# Altium schematic sheet current amplifier 06.SchDoc: PHOTOELECTRIC EFFECT
size A3; ApprovedBy: NHOPPASIT S.; CheckedBy: NHOPPASIT S.; Author: NHOPPASIT S.; DrawnBy: NHOPPASIT S.; DocumentNumber: EE-01; Revision: 1; SheetNumber: 1; SheetTotal: 1; Size: A3; PageSetup: Record=PageOptions|CenterHorizontal=True|CenterVertical=True|PrintScale=0.73|XCorrection=1.00|YCorrection=1.00|PrintKind=0|BorderSize=5000000|LeftOffset=0|BottomOffset=0|Orientation=2|PaperLength=1000|PaperWidth=1000|Scale=100|PaperSource=7|PrintQuality=-3|MediaType=1|DitherType=10|PrintScaleMode=1|PaperKind=A4|PaperIndex=9; DocumentName: PHOTOELECTRIC EFFECT SCH; ProjectName: PHOTOELECTRIC EFFECT 01
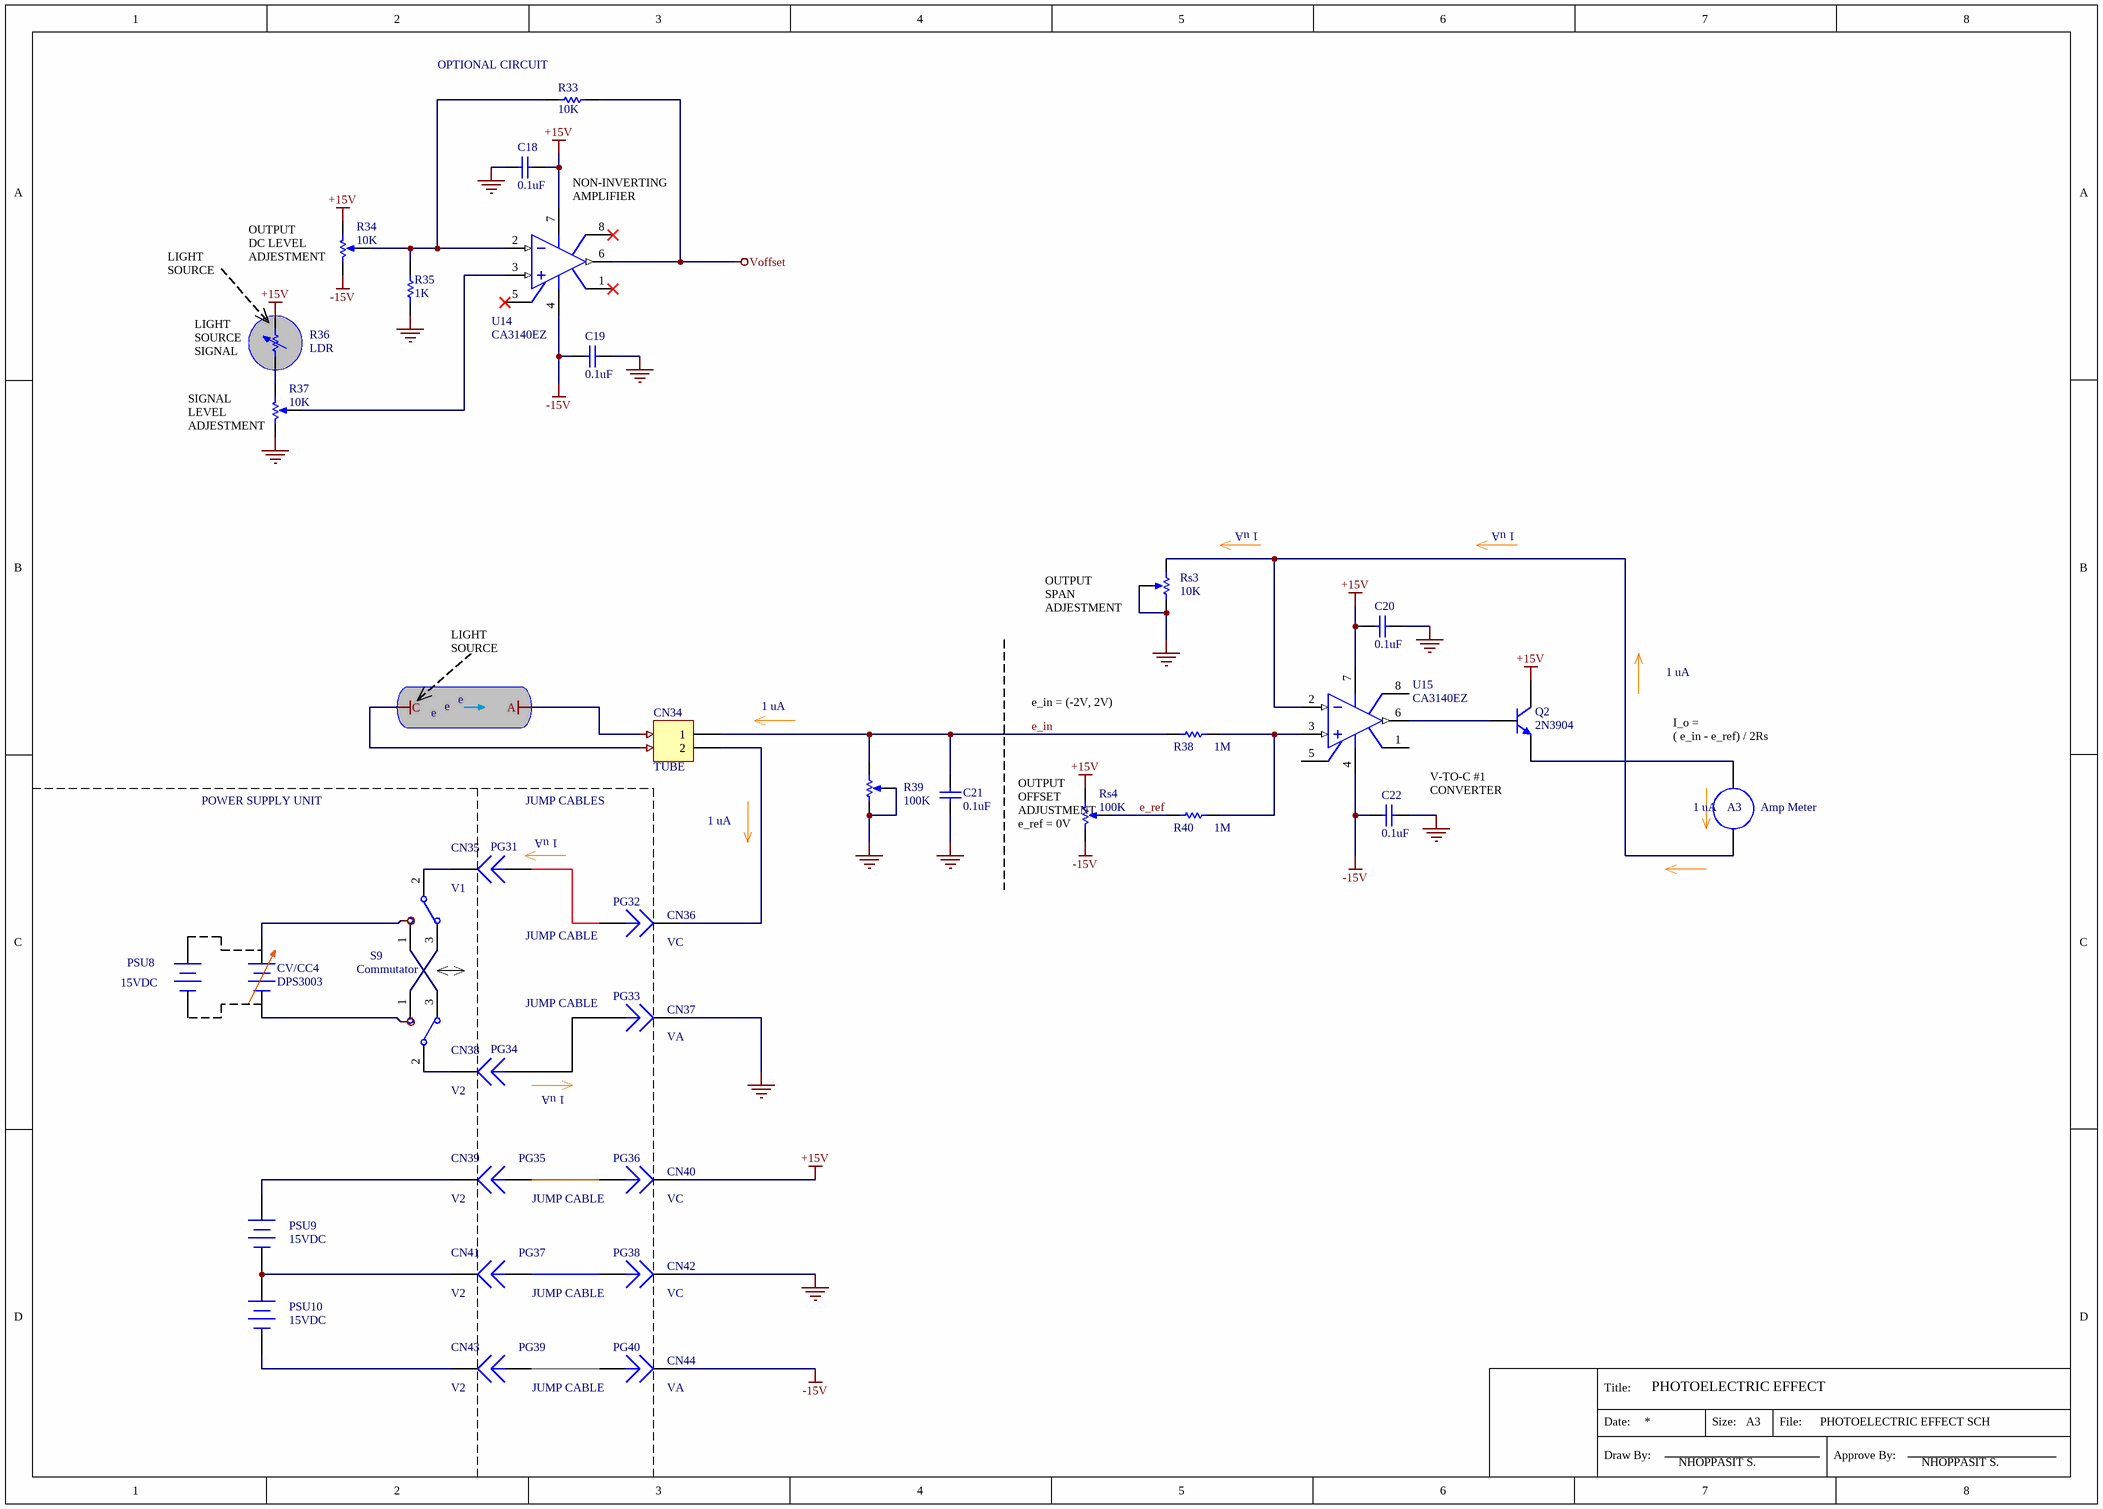
[diagram p0: current amplifier 06.SchDoc]

## Parts
A3  Amp Meter  [RAD-0.1]
C18  0.1uF  [RAD-0.3]
C19  0.1uF  [RAD-0.3]
C20  0.1uF  [RAD-0.3]
C21  0.1uF  [RAD-0.3]
C22  0.1uF  [RAD-0.3]
CN34  TUBE  [HDR1X2]
CN35  V1  [PIN1]
CN36  VC  [PIN1]
CN37  VA  [PIN1]
CN38  V2  [PIN1]
CN39  V2  [PIN1]
CN40  VC  [PIN1]
CN41  V2  [PIN1]
CN42  VC  [PIN1]
CN43  V2  [PIN1]
CN44  VA  [PIN1]
CV/CC4  DPS3003  [BAT-2]
PG31  Plug  [PIN1]  (value not drawn)
PG32  Plug  [PIN1]  (value not drawn)
PG33  Plug  [PIN1]  (value not drawn)
PG34  Plug  [PIN1]  (value not drawn)
PG35  Plug  [PIN1]  (value not drawn)
PG36  Plug  [PIN1]  (value not drawn)
PG37  Plug  [PIN1]  (value not drawn)
PG38  Plug  [PIN1]  (value not drawn)
PG39  Plug  [PIN1]  (value not drawn)
PG40  Plug  [PIN1]  (value not drawn)
PSU8  15VDC  [BAT-2]
PSU9  15VDC  [BAT-2]
PSU10  15VDC  [BAT-2]
Q2  2N3904  [TO-92A]
R33  10K  [AXIAL-0.3]
R34  10K  [VR5]
R35  1K  [AXIAL-0.3]
R36  LDR  [AXIAL-0.7]
R37  10K  [VR5]
R38  1M  [AXIAL-0.3]
R39  100K  [VR5]
R40  1M  [AXIAL-0.3]
Rs3  10K  [VR5]
Rs4  100K  [VR5]
S9  Commutator  [TL36WW15050]
S10  SW-SPDT  [TL36WW15050]  (value not drawn)
U14  CA3140EZ  [H-08A]
U15  CA3140EZ  [H-08A]

## Nets
+15V: C18.2 C20.1 CN40.1 Q2.3(C) R34.1(TOP) R36.2 Rs4.1(TOP) U14.7(V+) U15.7(V+)
-15V: C19.1 C22.1 CN44.1 R34.2(BOT) Rs4.2(BOT) U14.4(V-) U15.4(V-)
A: CV/CC4.1(+) CV/CC4.2(-)  [also labelled C, VCC]
GND: C18.1 C19.2 C20.2 C21.1 C22.2 CN37.1 CN42.1 R35.1 R37.2(BOT) R39.1(TOP) R39.3(TAP) Rs3.2(BOT) Rs3.3(TAP)
Voffset: R33.2 U14.6(OUT)
e_in: C21.2 CN34.1 R38.1 R39.2(BOT)
e_ref: R40.1 Rs4.3(TAP)
NetA3_1: A3.1 Rs3.1(TOP) U15.2(IN-)
NetA3_2: A3.2 Q2.1(E)
NetCN34_2: CN34.2 CN36.1
NetCN35_1: CN35.1 S9.2
NetCN38_1: CN38.1 S10.2
NetCN39_1: CN39.1 PSU9.1(+)
NetCN41_1: CN41.1 PSU9.2(-) PSU10.1(+)
NetCN43_1: CN43.1 PSU10.2(-)
NetPG31_1: PG31.1 PG32.1
NetPG33_1: PG33.1 PG34.1
NetPG35_1: PG35.1 PG36.1
NetPG37_1: PG37.1 PG38.1
NetPG39_1: PG39.1 PG40.1
NetQ2_2: Q2.2(B) U15.6(OUT)
NetR33_1: R33.1 R34.3(TAP) R35.2 U14.2(IN-)
NetR36_1: R36.1 R37.1(TOP)
NetR37_3: R37.3(TAP) U14.3(IN+)
NetR38_2: R38.2 R40.2 U15.3(IN+)
NetS9_1: S9.1 S10.3
NetS9_3: S9.3 S10.1

Not connected (* = marked no-connect by the designer): PSU8 1(+) 2(-); U14 1(OS_NUL)* 5(OS_NUL)* 8(TAB)*; U15 1(OS_NUL) 5(OS_NUL) 8(TAB)

## Notes on the sheet
- (near R33) OPTIONAL CIRCUIT
- NON-INVERTING
  AMPLIFIER
- LIGHT SOURCE
- (near R34) OUTPUT
  DC LEVEL
  ADJESTMENT
- (near R36) LIGHT SOURCE
  SIGNAL
- (near R37) SIGNAL
  LEVEL
  ADJESTMENT
- 1 uA
- (near Rs3) OUTPUT
  SPAN
  ADJESTMENT
- e
- e_in = (-2V, 2V)
- (near A3) I_o =
  ( e_in - e_ref) / 2Rs
- POWER SUPPLY UNIT
- JUMP CABLES
- (near PG31) 1 uA
- (near Rs4) OUTPUT
  OFFSET
  ADJUSTMENT
  e_ref = 0V
- V-TO-C #1
  CONVERTER
- (near A3) 1 uA
- JUMP CABLE
- (near PG34) 1 uA
- Title:
- Date:
- Draw By:
- Size:
- File:
- Approve By:

## Library data of the parts
A3 = Meter: Indicating Instrument; Note: Place a "letter" into the symbol to show the function of the meter or instrument; Published: 24-Mar-1999; LatestRevisionDate: 17-Jul-2002; LatestRevisionNote: Re-released for DXP Platform.; PackageReference: RAD-0.1; Publisher: Altium Limited; PackageDescription: Radial Cap, Thru-Hole; 2 Leads; 0.1 in Pin Spacing
C18-C22 = Cap: Capacitor; Published: 8-Jun-2000; LatestRevisionDate: 17-Jul-2002; LatestRevisionNote: Re-released for DXP Platform.; PackageReference: RAD-0.3; Publisher: Altium Limited; PackageDescription: Radial Cap, Thru-Hole; 2 Leads; 0.3 in Pin Spacing; Value: 0.1uF
CN34 = Header 2: Header, 2-Pin; LatestRevisionDate: 17-Jul-2002; LatestRevisionNote: Re-released for DXP Platform.; Publisher: Altium Limited
CN35-CN44 = Socket: LatestRevisionDate: 17-Jul-2002; LatestRevisionNote: Re-released for DXP Platform.; Publisher: Altium Limited
CV/CC4 PSU8-PSU10 = Battery: Multicell Battery; Published: 24-Mar-1999; LatestRevisionDate: 17-Jul-2002; LatestRevisionNote: Re-released for DXP Platform.; PackageReference: BAT-2; Publisher: Altium Limited; PackageDescription: Battery; 2 Leads
Q2 = 2N3904: NPN General Purpose Amplifier; Published: 8-Jun-2000; LatestRevisionDate: 15-Jan-2003; LatestRevisionNote: PCB Footprint 'BCY-W3/D4.7' replaced; DatasheetVersion: 1997; PackageVersion: Sep-1998; PackageReference: TO-92A; Publisher: Altium Limited; PackageDescription: TO, Flat Index; 3 In-Line, Axial Leads; Body Dia. 4.5mm; Leads 0.51 x 0.48 mm (max); ComponentLink1Description: Manufacturer Link; ComponentLink1URL: http://www.fairchildsemi.com/; ComponentLink2Description: Datasheet; ComponentLink2URL: http://www.fairchildsemi.com/ds/2N%2F2N3904.pdf
R33 R35 R38 R40 = Res1: Resistor; Published: 8-Jun-2000; LatestRevisionDate: 17-Jul-2002; LatestRevisionNote: Re-released for DXP Platform.; PackageReference: AXIAL-0.3; Publisher: Altium Limited; PackageDescription: Axial Device, Thru-Hole; 2 Leads; 0.3 in Pin Spacing
  R33: Value: 10K
  R35: Value: 1K
  R38 R40: Value: 1M
R34 R37 R39 Rs3 Rs4 = RPot: Potentiometer; Sim Note: Enter the Resistance value and the set point into parameter fields.; Set Position: 0.5; Published: 8-Jun-2000; LatestRevisionDate: 17-Jul-2002; LatestRevisionNote: Re-released for DXP Platform.; PackageReference: VR5; Publisher: Altium Limited; PackageDescription: Variable Resistor, Thru-Hole; 3 Leads
  R34 R37 Rs3: Value: 10K
  R39 Rs4: Value: 100K
R36 = Res Adj1: Variable Resistor; Value: 1K; Set Position: 0.5; Published: 8-Jun-2000; LatestRevisionDate: 17-Jul-2002; LatestRevisionNote: Re-released for DXP Platform.; PackageReference: AXIAL-0.7; Publisher: Altium Limited; PackageDescription: Axial Device, Thru-Hole; 2 Leads; 0.7 in Pin Spacing
S9 S10 = SW-SPDT: SPDT Subminiature Toggle Switch, Right Angle Mounting, Vertical Actuation; Published: 24-Mar-1999; LatestRevisionDate: 17-Dec-2003; LatestRevisionNote: Schematic revised, PCB Footprint replaced.; DatasheetVersion: 05-Dec-2000; PackageReference: TL36WW15050; Publisher: Altium Limited; PackageDescription: Switch; 4 Leads; ComponentLink1Description: Manufacturer Link; ComponentLink1URL: http://www.apem.com
U14 U15 = Op Amp: FET Operational Amplifier; Published: 8-Jun-2000; LatestRevisionDate: 17-Jul-2002; LatestRevisionNote: Re-released for DXP Platform.; DatasheetVersion: REV. B; PackageVersion: 1990; PackageReference: H-08A; Publisher: Altium Limited; PackageDescription: Can; 8 Leads; Pin Circle Dia. 5.08 mm; Lead Dia. 0.53 mm (max); ComponentLink1Description: Manufacturer Link; ComponentLink1URL: http://www.analog.com/
PG31-PG40 = Plug: LatestRevisionDate: 17-Jul-2002; LatestRevisionNote: Re-released for DXP Platform.; Publisher: Altium Limited